# Altium project LSM303DLHC_ACC.PrjPcb
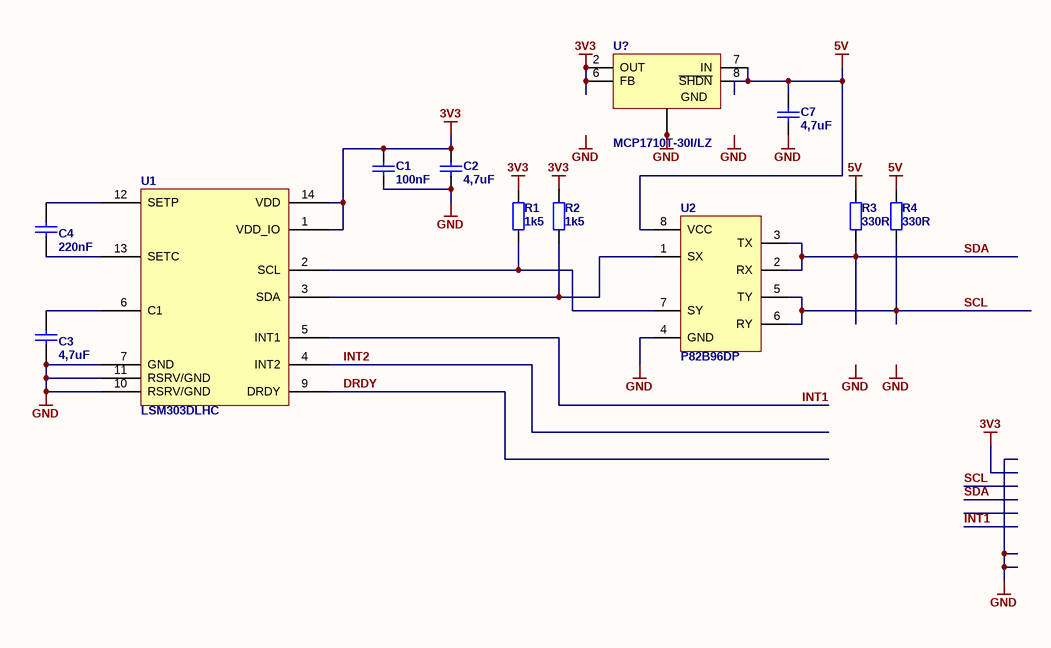
[diagram p0: sch.SchDoc]
1 sheet, 12 parts. Net scope: global (net labels, ports and power ports of the same name join across sheets).
Board file: pcb.PcbDoc

## Sheet sch.SchDoc: X
size A4; Date: DD-MM-YYYY; CheckedBy: X; DrawnBy: Y; Revision: 0.0.0; SheetNumber: X; SheetTotal: Y; Projectnumber: OWN-000; Size: A4; Projectname: X

### Parts
C1  100nF  [C0402]
C2  4,7uF  [C0402]
C3  4,7uF  [C0402]
C4  220nF  [C0402]
C7  4,7uF  [C0402]
R1  1k5  [R0402]
R2  1k5  [R0402]
R3  330R  [R0402]
R4  330R  [R0402]
U1  LSM303DLHC  [LGA80P500X300-14N]
U2  P82B96DP  [TSSOP8N]
U?  MCP1710T-30I/LZ  [VDFN8]

### Nets
3V3: C1.2 C2.2 R1.2 R2.2 U1.1(VDD_IO) U1.14(VDD) U?.2(OUT) U?.6(FB)
5V: C7.2 R3.2 R4.2 U2.8(VCC) U?.7(IN) U?.8(~{SHDN})
GND: C1.1 C2.1 C3.1 C7.1 U1.7(GND) U1.10(RSRV/GND) U1.11(RSRV/GND) U2.4(GND) U?.1(GND) U?.3(GND) U?.4(GND) U?.5(GND) U?.9(GND)
DRDY: U1.9(DRDY)
INT1: U1.5(INT1)
INT2: U1.4(INT2)
SCL: R4.1 U2.5(TY) U2.6(RY)
SDA: R3.1 U2.2(RX) U2.3(TX)
NetC3_2: C3.2 U1.6(C1)
NetC4_1: C4.1 U1.13(SETC)
NetC4_2: C4.2 U1.12(SETP)
NetR1_1: R1.1 U1.2(SCL) U2.7(SY)
NetR2_1: R2.1 U1.3(SDA) U2.1(SX)

Not connected (* = marked no-connect by the designer): U1 8(NC)

### Notes on the sheet
- Labels drawn without touching a wire or pin: GND
- PROJECT NAME:
- PROJECT NO.:
- DATE:
- TITLE:
- SHEET
- of
- DRAWN BY:
- REVISION:
- FILENAME:
- A4

### Library data of the parts
C1-C4 C7 = Cap: Capacitor; ComponentLink1Description: datasheet; ComponentLink2Description: supplier
  C1: Value: 100nF
  C2 C3 C7: Value: 4,7uF
  C4: Value: 220nF
R1-R4 = Res: Resistor; Published: 19-Feb-2006; ComponentLink1Description: datasheet; ComponentLink2Description: supplier
  R1 R2: Value: 1k5
  R3 R4: Value: 330R
U1 = LSM303DLHC: Ultra compact high performance e-compass 3D accelerometer and  3D magnetometer module
U2 = P82B96DP: Dual Bidirectional I2C Bus Buffer, TSSOP8 Package
U? = MCP1710T-30I/LZ: 200mA, Low Voltage, Low Quiescent Current (20nA) LDO Voltage Regulator; Published: 24-Aug-2001; LatestRevisionDate: 06-Jun-2005; LatestRevisionNote: PCB Pin sequence re-ordered.; DatasheetVersion: Feb-2004; PackageVersion: Jul-2004; PackageReference: TO-220A; Publisher: Altium Limited; PackageDescription: TO, Thru-Hole, Vertical, Heatsink Mounted; 3 In-Line Leads; Pitch 2.54 mm; ComponentLink1Description: Manufacturer Link; ComponentLink1URL: http://www.st.com/; ComponentLink2Description: Datasheet; ComponentLink2URL: http://www.st.com/stonline/books/pdf/docs/2574.pdf